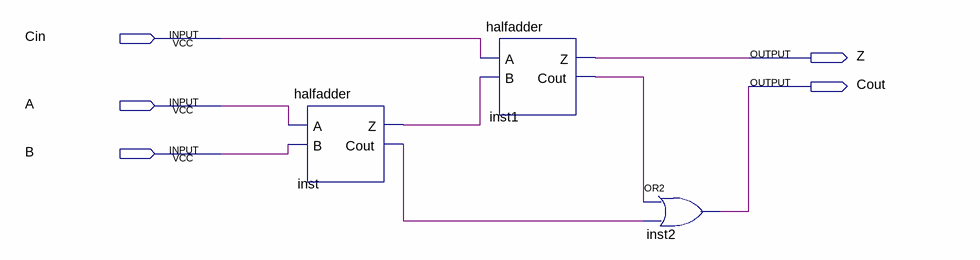
[diagram p0: schematic sheet]
// Quartus schematic fulladder.bdf as structural Verilog: 3 symbols, 5 pins
module fulladder (
  input  Cin,
  input  A,
  input  B,
  output Z,
  output Cout
);

  wire inst1_cout, inst_cout, inst_z;

  halfadder inst (.A(A), .B(B), .Z(inst_z), .Cout(inst_cout));
  halfadder inst1 (.A(Cin), .B(inst_z), .Z(Z), .Cout(inst1_cout));
  or inst2 (Cout, inst1_cout, inst_cout);
endmodule
